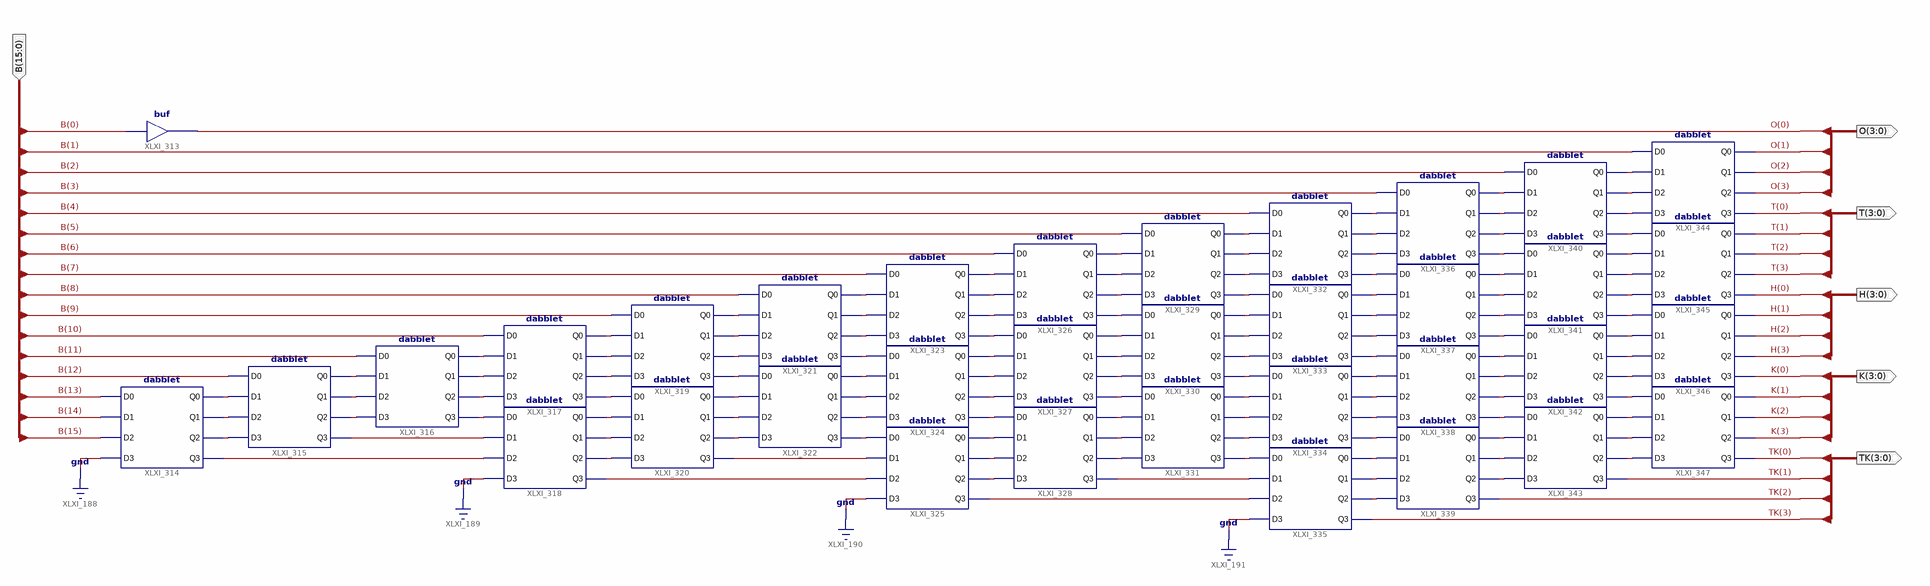
[diagram p0: schematic sheet 1]
// Xilinx ISE schematic dd16tb.sch (spartan6) as structural Verilog: 35 symbols, 6 ports
module dd16tb (
  input  [15:0] B,
  output [3:0] O,
  output [3:0] T,
  output [3:0] H,
  output [3:0] K,
  output [3:0] TK
);

  wire XLXN_2, XLXN_3, XLXN_4, XLXN_5, XLXN_6, XLXN_7, XLXN_8, XLXN_9, XLXN_10, XLXN_11, XLXN_12, XLXN_13,
       XLXN_14, XLXN_15, XLXN_16, XLXN_19, XLXN_20, XLXN_21, XLXN_22, XLXN_23, XLXN_24, XLXN_25, XLXN_26,
       XLXN_27, XLXN_28, XLXN_29, XLXN_30, XLXN_31, XLXN_32, XLXN_33, XLXN_34, XLXN_35, XLXN_36, XLXN_37,
       XLXN_38, XLXN_39, XLXN_40, XLXN_41, XLXN_42, XLXN_43, XLXN_44, XLXN_45, XLXN_46, XLXN_47, XLXN_48,
       XLXN_49, XLXN_50, XLXN_51, XLXN_52, XLXN_53, XLXN_54, XLXN_55, XLXN_56, XLXN_57, XLXN_58, XLXN_59,
       XLXN_60, XLXN_62, XLXN_63, XLXN_64, XLXN_65, XLXN_66, XLXN_67, XLXN_68, XLXN_69, XLXN_70, XLXN_71,
       XLXN_72, XLXN_73, XLXN_74, XLXN_75, XLXN_76, XLXN_77, XLXN_78, XLXN_79, XLXN_80, XLXN_81, XLXN_82,
       XLXN_83, XLXN_84, XLXN_85, XLXN_86, XLXN_87, XLXN_88, XLXN_89, XLXN_90, XLXN_91, XLXN_92, XLXN_94,
       XLXN_95, XLXN_96, XLXN_97, XLXN_98, XLXN_99, XLXN_100, XLXN_101, XLXN_102, XLXN_103, XLXN_104,
       XLXN_105, XLXN_106, XLXN_107, XLXN_108, XLXN_109, XLXN_110, XLXN_111, XLXN_112, XLXN_114, XLXN_115,
       XLXN_116, XLXN_117, XLXN_124, XLXN_125, XLXN_126, XLXN_129, XLXN_130, XLXN_131;

  buf XLXI_313 (O[0], B[0]);
  dabblet XLXI_314 (
    .D0(B[13]), .D1(B[14]), .D2(B[15]), .D3(1'b0), .Q0(XLXN_129), .Q1(XLXN_130), .Q2(XLXN_131), .Q3(XLXN_124));
  dabblet XLXI_315 (
    .D0(B[12]), .D1(XLXN_129), .D2(XLXN_130), .D3(XLXN_131), .Q0(XLXN_114), .Q1(XLXN_115), .Q2(XLXN_116),
    .Q3(XLXN_117));
  dabblet XLXI_316 (
    .D0(B[11]), .D1(XLXN_114), .D2(XLXN_115), .D3(XLXN_116), .Q0(XLXN_109), .Q1(XLXN_110), .Q2(XLXN_111),
    .Q3(XLXN_112));
  dabblet XLXI_317 (
    .D0(B[10]), .D1(XLXN_109), .D2(XLXN_110), .D3(XLXN_111), .Q0(XLXN_102), .Q1(XLXN_103), .Q2(XLXN_104),
    .Q3(XLXN_105));
  dabblet XLXI_318 (
    .D0(XLXN_112), .D1(XLXN_117), .D2(XLXN_124), .D3(1'b0), .Q0(XLXN_106), .Q1(XLXN_107), .Q2(XLXN_108),
    .Q3(XLXN_125));
  dabblet XLXI_319 (
    .D0(B[9]), .D1(XLXN_102), .D2(XLXN_103), .D3(XLXN_104), .Q0(XLXN_94), .Q1(XLXN_95), .Q2(XLXN_96),
    .Q3(XLXN_97));
  dabblet XLXI_320 (
    .D0(XLXN_105), .D1(XLXN_106), .D2(XLXN_107), .D3(XLXN_108), .Q0(XLXN_98), .Q1(XLXN_99), .Q2(XLXN_100),
    .Q3(XLXN_101));
  dabblet XLXI_321 (
    .D0(B[8]), .D1(XLXN_94), .D2(XLXN_95), .D3(XLXN_96), .Q0(XLXN_85), .Q1(XLXN_86), .Q2(XLXN_87),
    .Q3(XLXN_88));
  dabblet XLXI_322 (
    .D0(XLXN_97), .D1(XLXN_98), .D2(XLXN_99), .D3(XLXN_100), .Q0(XLXN_89), .Q1(XLXN_90), .Q2(XLXN_91),
    .Q3(XLXN_92));
  dabblet XLXI_323 (
    .D0(B[7]), .D1(XLXN_85), .D2(XLXN_86), .D3(XLXN_87), .Q0(XLXN_74), .Q1(XLXN_75), .Q2(XLXN_76),
    .Q3(XLXN_77));
  dabblet XLXI_324 (
    .D0(XLXN_88), .D1(XLXN_89), .D2(XLXN_90), .D3(XLXN_91), .Q0(XLXN_78), .Q1(XLXN_79), .Q2(XLXN_80),
    .Q3(XLXN_81));
  dabblet XLXI_325 (
    .D0(XLXN_92), .D1(XLXN_101), .D2(XLXN_125), .D3(1'b0), .Q0(XLXN_82), .Q1(XLXN_83), .Q2(XLXN_84),
    .Q3(XLXN_126));
  dabblet XLXI_326 (
    .D0(B[6]), .D1(XLXN_74), .D2(XLXN_75), .D3(XLXN_76), .Q0(XLXN_62), .Q1(XLXN_63), .Q2(XLXN_64),
    .Q3(XLXN_65));
  dabblet XLXI_327 (
    .D0(XLXN_77), .D1(XLXN_78), .D2(XLXN_79), .D3(XLXN_80), .Q0(XLXN_66), .Q1(XLXN_67), .Q2(XLXN_68),
    .Q3(XLXN_69));
  dabblet XLXI_328 (
    .D0(XLXN_81), .D1(XLXN_82), .D2(XLXN_83), .D3(XLXN_84), .Q0(XLXN_70), .Q1(XLXN_71), .Q2(XLXN_72),
    .Q3(XLXN_73));
  dabblet XLXI_329 (
    .D0(B[5]), .D1(XLXN_62), .D2(XLXN_63), .D3(XLXN_64), .Q0(XLXN_43), .Q1(XLXN_50), .Q2(XLXN_51),
    .Q3(XLXN_52));
  dabblet XLXI_330 (
    .D0(XLXN_65), .D1(XLXN_66), .D2(XLXN_67), .D3(XLXN_68), .Q0(XLXN_53), .Q1(XLXN_54), .Q2(XLXN_55),
    .Q3(XLXN_56));
  dabblet XLXI_331 (
    .D0(XLXN_69), .D1(XLXN_70), .D2(XLXN_71), .D3(XLXN_72), .Q0(XLXN_57), .Q1(XLXN_58), .Q2(XLXN_59),
    .Q3(XLXN_60));
  dabblet XLXI_332 (
    .D0(B[4]), .D1(XLXN_43), .D2(XLXN_50), .D3(XLXN_51), .Q0(XLXN_34), .Q1(XLXN_35), .Q2(XLXN_36),
    .Q3(XLXN_37));
  dabblet XLXI_333 (
    .D0(XLXN_52), .D1(XLXN_53), .D2(XLXN_54), .D3(XLXN_55), .Q0(XLXN_38), .Q1(XLXN_39), .Q2(XLXN_40),
    .Q3(XLXN_41));
  dabblet XLXI_334 (
    .D0(XLXN_56), .D1(XLXN_57), .D2(XLXN_58), .D3(XLXN_59), .Q0(XLXN_42), .Q1(XLXN_44), .Q2(XLXN_45),
    .Q3(XLXN_46));
  dabblet XLXI_335 (
    .D0(XLXN_60), .D1(XLXN_73), .D2(XLXN_126), .D3(1'b0), .Q0(XLXN_47), .Q1(XLXN_48), .Q2(XLXN_49), .Q3(TK[3]));
  dabblet XLXI_336 (
    .D0(B[3]), .D1(XLXN_34), .D2(XLXN_35), .D3(XLXN_36), .Q0(XLXN_33), .Q1(XLXN_32), .Q2(XLXN_31),
    .Q3(XLXN_30));
  dabblet XLXI_337 (
    .D0(XLXN_37), .D1(XLXN_38), .D2(XLXN_39), .D3(XLXN_40), .Q0(XLXN_29), .Q1(XLXN_28), .Q2(XLXN_27),
    .Q3(XLXN_26));
  dabblet XLXI_338 (
    .D0(XLXN_41), .D1(XLXN_42), .D2(XLXN_44), .D3(XLXN_45), .Q0(XLXN_25), .Q1(XLXN_24), .Q2(XLXN_23),
    .Q3(XLXN_22));
  dabblet XLXI_339 (
    .D0(XLXN_46), .D1(XLXN_47), .D2(XLXN_48), .D3(XLXN_49), .Q0(XLXN_21), .Q1(XLXN_20), .Q2(XLXN_19),
    .Q3(TK[2]));
  dabblet XLXI_340 (
    .D0(B[2]), .D1(XLXN_33), .D2(XLXN_32), .D3(XLXN_31), .Q0(XLXN_2), .Q1(XLXN_3), .Q2(XLXN_4), .Q3(XLXN_5));
  dabblet XLXI_341 (
    .D0(XLXN_30), .D1(XLXN_29), .D2(XLXN_28), .D3(XLXN_27), .Q0(XLXN_6), .Q1(XLXN_7), .Q2(XLXN_8), .Q3(XLXN_9));
  dabblet XLXI_342 (
    .D0(XLXN_26), .D1(XLXN_25), .D2(XLXN_24), .D3(XLXN_23), .Q0(XLXN_10), .Q1(XLXN_11), .Q2(XLXN_12),
    .Q3(XLXN_13));
  dabblet XLXI_343 (
    .D0(XLXN_22), .D1(XLXN_21), .D2(XLXN_20), .D3(XLXN_19), .Q0(XLXN_14), .Q1(XLXN_15), .Q2(XLXN_16),
    .Q3(TK[1]));
  dabblet XLXI_344 (.D0(B[1]), .D1(XLXN_2), .D2(XLXN_3), .D3(XLXN_4), .Q0(O[1]), .Q1(O[2]), .Q2(O[3]), .Q3(T[0]));
  dabblet XLXI_345 (.D0(XLXN_5), .D1(XLXN_6), .D2(XLXN_7), .D3(XLXN_8), .Q0(T[1]), .Q1(T[2]), .Q2(T[3]), .Q3(H[0]));
  dabblet XLXI_346 (.D0(XLXN_9), .D1(XLXN_10), .D2(XLXN_11), .D3(XLXN_12), .Q0(H[1]), .Q1(H[2]), .Q2(H[3]), .Q3(K[0]));
  dabblet XLXI_347 (
    .D0(XLXN_13), .D1(XLXN_14), .D2(XLXN_15), .D3(XLXN_16), .Q0(K[1]), .Q1(K[2]), .Q2(K[3]), .Q3(TK[0]));
endmodule
